# Altium schematic sheet A4_INSAGE_02.SchDoc: Puissance
size A4; Author: INSA GE; Organization: INSA de Lyon; Address1: Département Génie Électrique; Address2: Bâtiment Gustave Ferrié; Address3: 8, Rue de la Physique; Address4: 69621 VILLEURBANNE CEDEX; Revision: 0; SheetNumber: 2; SheetTotal: 3
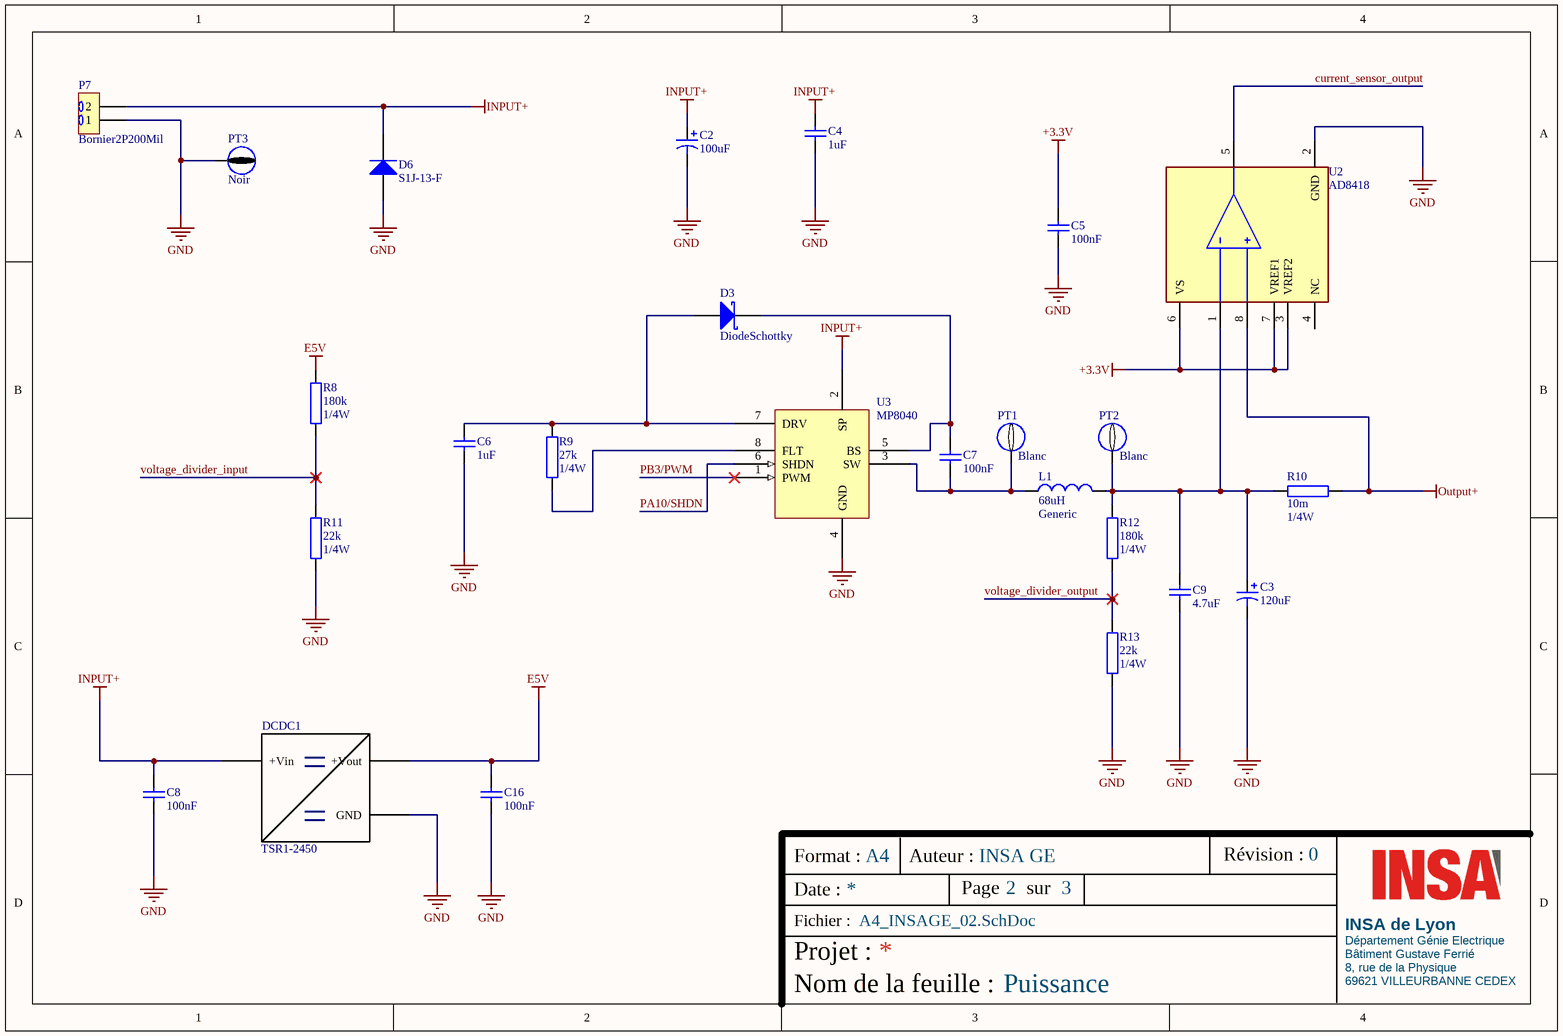
[diagram p0: A4_INSAGE_02.SchDoc]

## Parts
C2  value 100uF  [CAPRAD10diax9.5]  (hidden comment: Condensateur Pol)
C3  value 120uF  [CAPRAD10diax9.5]  (hidden comment: Condensateur Pol)
C4  value 1uF  [1206_C]  (hidden comment: Condensateur NON pol)
C5  value 100nF  [1206_C]  (hidden comment: Condensateur NON pol)
C6  value 1uF  [1206_C]  (hidden comment: Condensateur NON pol)
C7  value 100nF  [1206_C]  (hidden comment: Condensateur NON pol)
C8  value 100nF  [1206_C]  (hidden comment: Condensateur NON pol)
C9  value 4.7uF  [1206_C]  (hidden comment: Condensateur NON pol)
C16  value 100nF  [1206_C]  (hidden comment: Condensateur NON pol)
D3  DiodeSchottky  [DO-41]
D6  S1J-13-F  [SMA (DO-214AC)]
DCDC1  TSR1-2450  [TSR1Serie-1A]
L1  Generic  value 68uH  [7447709680]
P7  Bornier2P200Mil  [BORN2PIN200MIL]
PT1  Blanc  [PTest1.32mm]
PT2  Blanc  [PTest1.32mm]
PT3  Noir  [PTest1.32mm]
R8  value 180k  Puissance: 1/4W  [1206_R]  (hidden comment: Resistance)
R9  value 27k  Puissance: 1/4W  [1206_R]  (hidden comment: Resistance)
R10  value 10m  Puissance: 1/4W  [1206_R]  (hidden comment: Resistance)
R11  value 22k  Puissance: 1/4W  [1206_R]  (hidden comment: Resistance)
R12  value 180k  Puissance: 1/4W  [1206_R]  (hidden comment: Resistance)
R13  value 22k  Puissance: 1/4W  [1206_R]  (hidden comment: Resistance)
U2  AD8418  [SOIC-8-150]
U3  MP8040  [SOIC-8-150]

## Nets
+3.3V: C5.2 U2.3(VREF2) U2.6(VS) U2.7(VREF1)
E5V: C16.2 DCDC1.3(+Vout) R8.2
GND: C2.2 C3.2 C4.1 C5.1 C6.1 C8.1 C9.1 C16.1 D6.1(A) DCDC1.2(GND) P7.1 PT3.1 R11.1 R13.1 U2.2(GND) U3.4(GND)
INPUT+: C2.1 C4.2 C8.2 D6.2(K) DCDC1.1(+Vin) P7.2 U3.2(SP)
Output+: R10.1 U2.8(+IN)
current_sensor_output: U2.5(OUT)
PA10/SHDN: U3.6(SHDN)
PB3/PWM: U3.1(PWM)
voltage_divider_input: R8.1 R11.2
voltage_divider_output: R12.1 R13.2
NetC3_1: C3.1 C9.2 L1.2 PT2.1 R10.2 R12.2 U2.1(-IN)
NetC6_2: C6.2 D3.1(A) R9.2 U3.7(DRV)
NetC7_1: C7.1 L1.1 PT1.1 U3.3(SW)
NetC7_2: C7.2 D3.3(K) U3.5(BS)
NetR9_1: R9.1 U3.8(FLT)

Not connected (* = marked no-connect by the designer): U2 4(NC)

## Notes on the sheet
- Format :
- Date :
- A4
- Auteur :
- Page
- sur
- Révision :
- Projet :
- Fichier :
- INSA de Lyon
- Département Génie Electrique
- 8, rue de la Physique
- 69621 VILLEURBANNE CEDEX
- Nom de la feuille :

## Library data of the parts
D3 = 1N5819: Low drop power Schottky rectifier; pin to pad: 3>2; Published: 21-Mar-2003; LatestRevisionDate: 29-May-2009; LatestRevisionNote: IPC-7351 Footprint Added.; DatasheetVersion: Oct-1999; PackageVersion: Sep-2001; Publisher: Altium Limited
D6 = S1J-13-F: Diode standard de redressement 600V 1A; Supplier 1: RSComponents; Supplier 2: Farnell; Supplier Part Number 1: 708-2194; Supplier Part Number 2: 1773481
DCDC1 = TSR1-2450: DC/DC 6,5/36 -> 5V 1A; Supplier 1: RSComponents; Supplier Part Number 1: 9068484
L1 = Würth_7447709680: Inductance 7447709680 Würth; Code_IEC: 1005; Published: 8-Jun-2000; LatestRevisionDate: 29-May-2009; LatestRevisionNote: IPC-7351 Footprint Added.; PackageReference: 0402-A; Publisher: Altium Limited; PackageDescription: Chip Inductor; Code_JEITA: 0402; Supplier 1: RSComponents; Supplier Part Number 1: 814-2660P
P7 = Bornier2P200Mil: Bornier 2P 200mil; LatestRevisionDate: 17-Jul-2002; LatestRevisionNote: Re-released for DXP Platform.; Publisher: Altium Limited; Supplier 1: Farnell; Supplier Part Number 1: 2396250
PT1 PT2 = PTest_Blanc: Point de test PCB, Blanc, Montage traversant, 1.32 mm; Supplier 1: Farnell; Supplier Part Number 1: 8731225
PT3 = PTest_Noir: Point de test PCB, Noir, Montage traversant, 1.32 mm; Supplier 1: Farnell; Supplier Part Number 1: 8731250
R8-R13 = Resistance: Resistor; Published: 8-Jun-2000; LatestRevisionDate: 29-May-2009; LatestRevisionNote: IPC-7351 Footprint Added.; PackageReference: J1-0603; Publisher: Altium Limited; PackageDescription: Chip Resistor
U2 = AD8418: IC Current Sensor; Max Supply Voltage: 5.5V; Common Mode Rejection Ratio: 90dB; Min Dual Supply Voltage: 1.35V; Power Supply Rejection Ratio (PSRR): 80dB; Slew Rate: 1V/µs; Max Dual Supply Voltage: 2.75V; Operating Supply Current: 4.1mA; Min Supply Voltage: 2.7V; Input Bias Current: 130uA; Input Offset Voltage (Vos): 200uV; Number of Circuits: 1; -3db Bandwidth: 250kHz; Input Capacitance: 2pF; Max Operating Temperature: 125°C; Lead Free: Contains Lead; Case/Package: SOIC; Mount: Surface Mount; Min Operating Temperature: -40°C; Packaging: Rail/Tube; RoHS Compliant: Yes; Number of Pins: 8; Contact Plating: Tin
U3 = MP8040: 9A, 24V Integrated Half-Bridge
C2 C3 = Condensateur Pol: Published: 8-Jun-2000; LatestRevisionDate: 17-Jul-2002; LatestRevisionNote: Re-released for DXP Platform.; PackageReference: POLAR0.8; Publisher: Altium Limited; PackageDescription: Polarized Capacitor; 2 Leads
C4-C9 C16 = Condensateur NON pol: Published: 8-Jun-2000; LatestRevisionDate: 29-May-2009; LatestRevisionNote: IPC-7351 Footprint Added.; PackageReference: C1206; Publisher: Altium Limited; PackageDescription: Chip Capacitor